# EAGLE design charger (EAGLE 7.5.0)
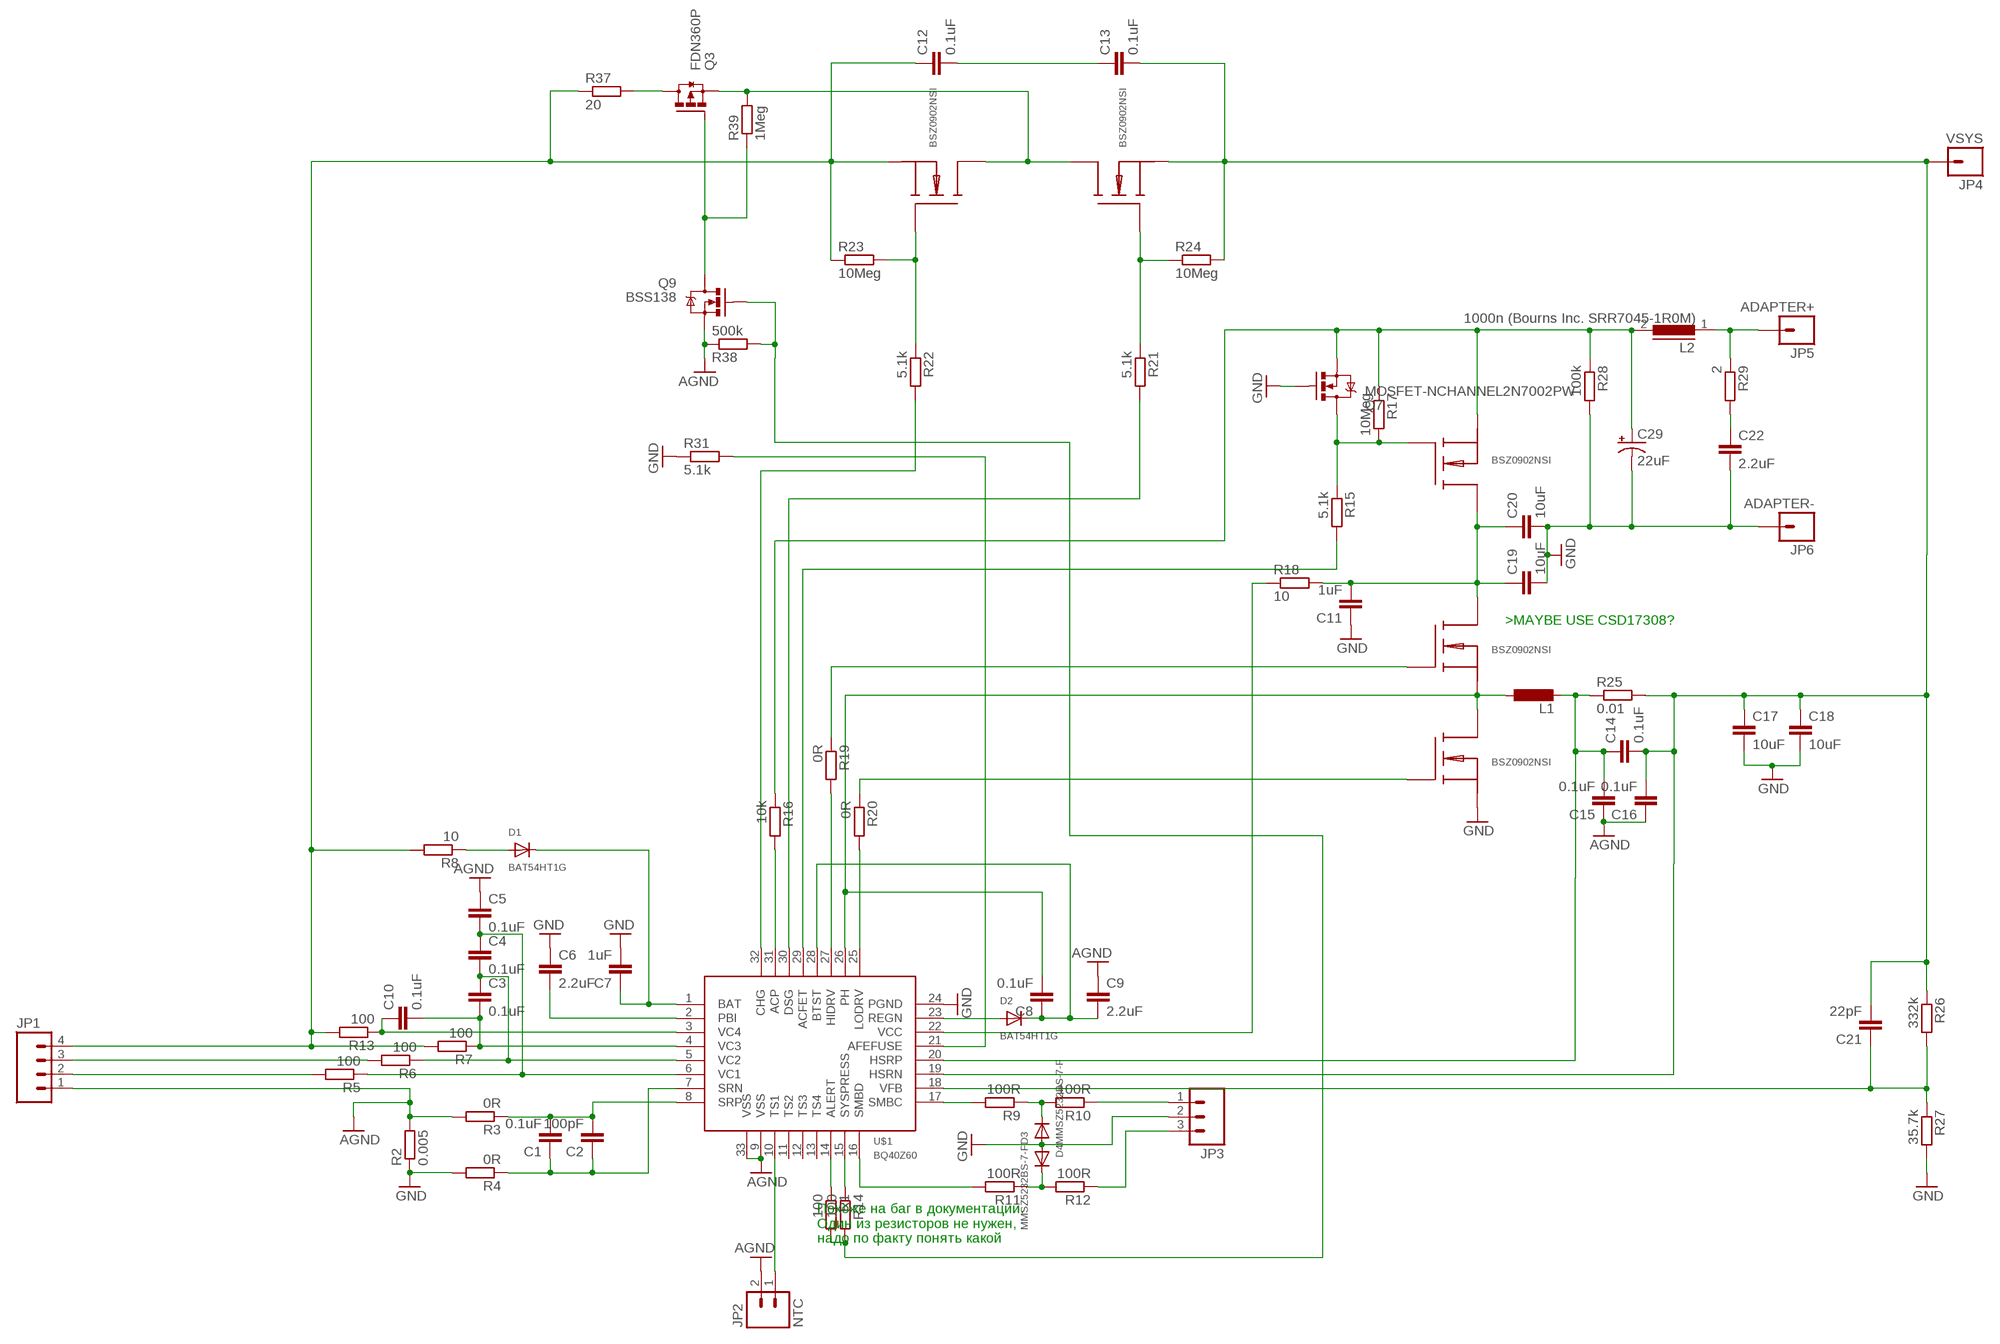
[diagram p0: schematic, sheet 1]

## Parts
C1  0.1uF  C-EUC0402  [C0402]
C2  100pF  C-EUC0402  [C0402]
C3  0.1uF  C-EUC0402  [C0402]
C4  0.1uF  C-EUC0402  [C0402]
C5  0.1uF  C-EUC0402  [C0402]
C6  2.2uF  C-EUC0805  [C0805]
C7  1uF  C-EUC0603  [C0603]
C8  0.1uF  C-EUC0402  [C0402]
C9  2.2uF  C-EUC0805  [C0805]
C10  0.1uF  C-EUC0402  [C0402]
C11  1uF  C-EUC0805  [C0805]
C12  0.1uF  C-EUC0402  [C0402]
C13  0.1uF  C-EUC0402  [C0402]
C14  0.1uF  C-EUC0402  [C0402]
C15  0.1uF  C-EUC0402  [C0402]
C16  0.1uF  C-EUC0402  [C0402]
C17  10uF  C-EUC1206  [C1206]
C18  10uF  C-EUC1206  [C1206]
C19  10uF  C-EUC1206  [C1206]
C20  10uF  C-EUC1206  [C1206]
C21  22pF  C-EUC0402  [C0402]
C22  2.2uF  C-EUC0805  [C0805]
C29  22uF  CAP_POL7343  [EIA7343]
D1  BAT54HT1G  DIODESOD-323F  [SOD-323F]
D2  BAT54HT1G  DIODESOD-323F  [SOD-323F]
D3  MMSZ5232BS-7-F  DIODESOD-323F  [SOD-323F]
D4  MMSZ5232BS-7-F  DIODESOD-323F  [SOD-323F]
JP1  M04PTH  [1X04]
JP2  NTC  M02PTH  [1X02]
JP3  M03PTH  [1X03]
JP4  VSYS  M01PTH_2MM  [1X01_2MM]
JP5  ADAPTER+  M01PTH_2MM  [1X01_2MM]
JP6  ADAPTER-  M01PTH_2MM  [1X01_2MM]
L1  L-EUL5650M  [L5650M]
L2  1000n (Bourns Inc. SRR7045-1R0M)  DR74  [DR74]
Q1  BSZ0902NSI  BSZ090X  [BSZ090X]
Q2  BSZ0902NSI  BSZ090X  [BSZ090X]
Q3  FDN360P  [SUPER-SOT3]
Q4  BSZ0902NSI  BSZ090X  [BSZ090X]
Q5  BSZ0902NSI  BSZ090X  [BSZ090X]
Q7  MOSFET-NCHANNEL2N7002PW  [SOT323]
Q8  BSZ0902NSI  BSZ090X  [BSZ090X]
Q9  BSS138  MOSFET-NCHANNEL2N7002PW  [SOT323]
R1  100  R-EU_R0402  [R0402]
R2  0.005  R-EU_R1210  [R1210]
R3  0R  R-EU_R0402  [R0402]
R4  0R  R-EU_R0402  [R0402]
R5  100  R-EU_R0603  [R0603]
R6  100  R-EU_R0603  [R0603]
R7  100  R-EU_R0603  [R0603]
R8  10  R-EU_R0603  [R0603]
R9  100R  R-EU_R0402  [R0402]
R10  100R  R-EU_R0402  [R0402]
R11  100R  R-EU_R0402  [R0402]
R12  100R  R-EU_R0402  [R0402]
R13  100  R-EU_R0603  [R0603]
R14  100  R-EU_R0402  [R0402]
R15  5.1k  R-EU_R0402  [R0402]
R16  10k  R-EU_R0402  [R0402]
R17  10Meg  R-EU_R0402  [R0402]
R18  10  R-EU_R1206  [R1206]
R19  0R  R-EU_R0402  [R0402]
R20  0R  R-EU_R0402  [R0402]
R21  5.1k  R-EU_R0402  [R0402]
R22  5.1k  R-EU_R0402  [R0402]
R23  10Meg  R-EU_R0402  [R0402]
R24  10Meg  R-EU_R0402  [R0402]
R25  0.01  R-EU_R2010  [R2010]
R26  332k  R-EU_R0402  [R0402]
R27  35.7k  R-EU_R0402  [R0402]
R28  100k  R-EU_R0402  [R0402]
R29  2  R-EU_R0603  [R0603]
R31  5.1k  R-EU_R0402  [R0402]
R37  20  R-EU_R1210  [R1210]
R38  500k  R-EU_R0402  [R0402]
R39  1Meg  R-EU_R0402  [R0402]
U$1  BQ40Z60  [BQ40Z60]

## Nets
AGND: C5.1 C9.1 C15.1 C16.1 JP1.1 JP2.2 Q9.2(S) R2.2 R3.2 R38.1 U$1.9(VSS) U$1.33(VSS)
GND [PWR]: C6.1 C7.2 C11.1 C17.2 C18.2 C19.2 C20.2 C22.2 C29.C(-) D3.A D4.A JP3.2 JP6.1 Q2.S@1(S) Q2.S@2(S) Q2.S@3(S) Q2.S@4(S) Q7.1(G) R2.1 R4.2 R27.2 R28.2 R31.1 U$1.24(PGND)
N$1: C1.2 C2.2 R3.1 U$1.8(SRP)
N$2: C1.1 C2.1 R4.1 U$1.7(SRN)
N$3: JP1.2 R5.2
N$4: C7.1 D1.C U$1.1(BAT)
N$5: C4.1 C5.2 R5.1 U$1.6(VC1)
N$6: C3.2 C10.2 R7.1 U$1.4(VC3)
N$7 [PWR]: JP1.4 R7.2 R8.2 R13.2
N$8: JP1.3 R6.2
N$9: C3.1 C4.2 R6.1 U$1.5(VC2)
N$10: C6.2 U$1.2(PBI)
N$11: D1.A R8.1
N$12: JP2.1 U$1.10(TS1)
N$13: R1.1 U$1.14(ALERT)
N$14: R9.2 U$1.17(SMBC)
N$15: R11.2 U$1.16(SMBD)
N$16: C10.1 R13.1 U$1.3(VC4)
N$17: D4.C R11.1 R12.2
N$18: D3.C R9.1 R10.2
N$19: JP3.1 R10.1
N$20: C22.1 R29.2
N$21 [PWR]: Q3.2(S) Q4.D Q4.D@1(D) Q4.D@2(D) Q4.D@3(D) Q4.D@4(D) Q5.D Q5.D@1(D) Q5.D@2(D) Q5.D@3(D) Q5.D@4(D) R39.2
N$22: JP3.3 R12.1
N$23: D2.A U$1.23(REGN)
N$24: C8.1 C9.2 D2.C U$1.28(BTST)
N$25: R31.2 U$1.21(AFEFUSE)
N$26 [PWR]: C12.1 Q4.S@1(S) Q4.S@2(S) Q4.S@3(S) Q4.S@4(S) R23.1 R37.1
N$27 [PWR]: C11.2 C19.1 C20.1 Q1.D Q1.D@1(D) Q1.D@2(D) Q1.D@3(D) Q1.D@4(D) Q8.D Q8.D@1(D) Q8.D@2(D) Q8.D@3(D) Q8.D@4(D) R18.2
N$28 [PWR]: C8.2 L1.1 Q1.S@1(S) Q1.S@2(S) Q1.S@3(S) Q1.S@4(S) Q2.D Q2.D@1(D) Q2.D@2(D) Q2.D@3(D) Q2.D@4(D) U$1.26(PH)
N$29: Q7.3(D) Q8.G R15.1 R17.2
N$30: R15.2 U$1.29(ACFET)
N$32: R16.2 U$1.31(ACP)
N$33: R18.1 U$1.22(VCC)
N$34: C21.1 R26.2 R27.1 U$1.18(VFB)
N$35: R19.2 U$1.27(HIDRV)
N$36: R20.2 U$1.25(LODRV)
N$37: Q1.G R19.1
N$38: Q2.G R20.1
N$39: R21.2 U$1.30(DSG)
N$40: Q5.G R21.1 R24.1
N$41: R22.2 U$1.32(CHG)
N$42: Q4.G R22.1 R23.2
N$43: C12.2 C13.1
N$44 [PWR]: C14.1 C15.2 L1.2 R25.1 U$1.20(HSRP)
N$45: C13.2 C14.2 C16.2 C17.1 C18.1 C21.2 JP4.1 Q5.S@1(S) Q5.S@2(S) Q5.S@3(S) Q5.S@4(S) R24.2 R25.2 R26.1 U$1.19(HSRN)
N$54: Q3.3(D) R37.2
N$56: Q9.1(G) R1.2 R14.2 R38.2
N$57: Q3.1(G) Q9.3(D) R39.1
N$58: R14.1 U$1.15(SYSPRESS)
N$59: C29.A(+) L2.2 Q7.2(S) Q8.S@1(S) Q8.S@2(S) Q8.S@3(S) Q8.S@4(S) R16.1 R17.1 R28.1
N$60: JP5.1 L2.1 R29.1
Unconnected: U$1.11(TS2) U$1.12(TS3) U$1.13(TS4)

## Notes on the sheet
- >MAYBE USE CSD17308?
- Похоже на баг в документации. 
  Один из резисторов не нужен, 
  надо по факту понять какой

## Library data of the parts
C1-C22 = resistor:C-EU: CAPACITOR, European symbol
C29 = SparkFun-Passives:CAP_POL: Capacitor Polarized These are standard SMD and PTH capacitors. Normally 10uF, 47uF, and 100uF in electrolytic and tantalum varieties. Always verify the external diameter of the through hole cap, it varies with capacity, voltage, and manufacturer. The EIA devices should be standard.
D1-D4 = adafruit:DIODE: Diode SMADIODE - SMA Surface Mount Package 20V 1A Schottky Diode Digikey: 641-1014-6-ND DO-1N4148 - Through Hole Small Current Diode SOD-123 20V 1 A (.5mV Vf) Schottky Diode - Digikey: MBRX120TPMSCT-ND SOD-323 10V 570mA (.38mV Vf, 3ns) Schottky Diode - Digikey: ZLLS410CT-ND SOD-523 30V 30mA Schottky Diode (RB751S-40TE61) - Digikey: RB751S-40TE61CT-ND SOT23-R/W - SOT23 Package (R = Solder Paste/Reflow Ovens, W = Hand-Soldering) BAT54Film 40V 300mA - Digikey: 497-7162-1-ND
JP1 = SparkFun-Connectors:M04: Header 4 Standard 4-pin 0.1" header. Use with straight break away headers (SKU : PRT-00116), right angle break away headers (PRT-00553), swiss pins (PRT-00743), machine pins (PRT-00117), and female headers (PRT-00115). Molex polarized connector foot print use with SKU : PRT-08231 with associated crimp pins and housings. 1MM SMD Version SKU: PRT-10208
JP2 = SparkFun-Connectors:M02: Standard 2-pin 0.1" header. Use with - straight break away headers ( PRT-00116) - right angle break away headers (PRT-00553) - swiss pins (PRT-00743) - machine pins (PRT-00117) - female headers (PRT-00115) Molex polarized connector foot print use with: PRT-08233 with associated crimp pins and housings. 2.54_SCREWTERM for use with PRT-10571. 3.5mm Screw Terminal footprints for PRT-08084 5mm Screw Terminal footprints for use with PRT-08432
JP3 = SparkFun-Connectors:M03: Header 3 Standard 3-pin 0.1" header. Use with straight break away headers (SKU : PRT-00116), right angle break away headers (PRT-00553), swiss pins (PRT-00743), machine pins (PRT-00117), and female headers (PRT-00115). Molex polarized connector foot print use with SKU : PRT-08232 with associated crimp pins and housings.
JP4-JP6 = SparkFun-Connectors:M01: Header 1 Standard 1-pin 0.1" header. Use with straight break away headers (SKU : PRT-00116), right angle break away headers (PRT-00553), swiss pins (PRT-00743), machine pins (PRT-00117), and female headers (PRT-00115).
L1 = rcl:L-EU: INDUCTOR, European symbol
L2 = inductors:DR74: High Power Density, High Efficiency, Shielded Inductors Source: coiltronics_dr_series.pdf
Q1 Q2 Q4 Q5 Q8 = vsd_custom:BSZ090X
Q3 = transistor-power:FDN360P: Single P-Channel, PowerTrench (R) MOSFET Source: http://www.fairchildsemi.com/ds/FD/FDN360P.pdf
Q7 Q9 = SparkFun-DiscreteSemi:MOSFET-NCHANNEL: Common NMOSFET Parts MFG P/N Store ID Prod ID FDD8780 TRANS-09984 SI7820DN TRANS-11055 FDS6630A IC-08089 2N7002PW TRANS-11151 FQP30N06L COM-10213 TRANS-10060 BSS123LT1G TRANS-08345 BSS138 TRANS-00830 BS170 2N7000; PROD_ID: TRANS-11151
R1-R29 R31 R37-R39 = resistor:R-EU_: RESISTOR, European symbol
U$1 = bq40z60:BQ40Z60

## Net classes
1 PWR: width 0.3 mm, drill 0.4 mm, clearance 0.152 mm

## Board
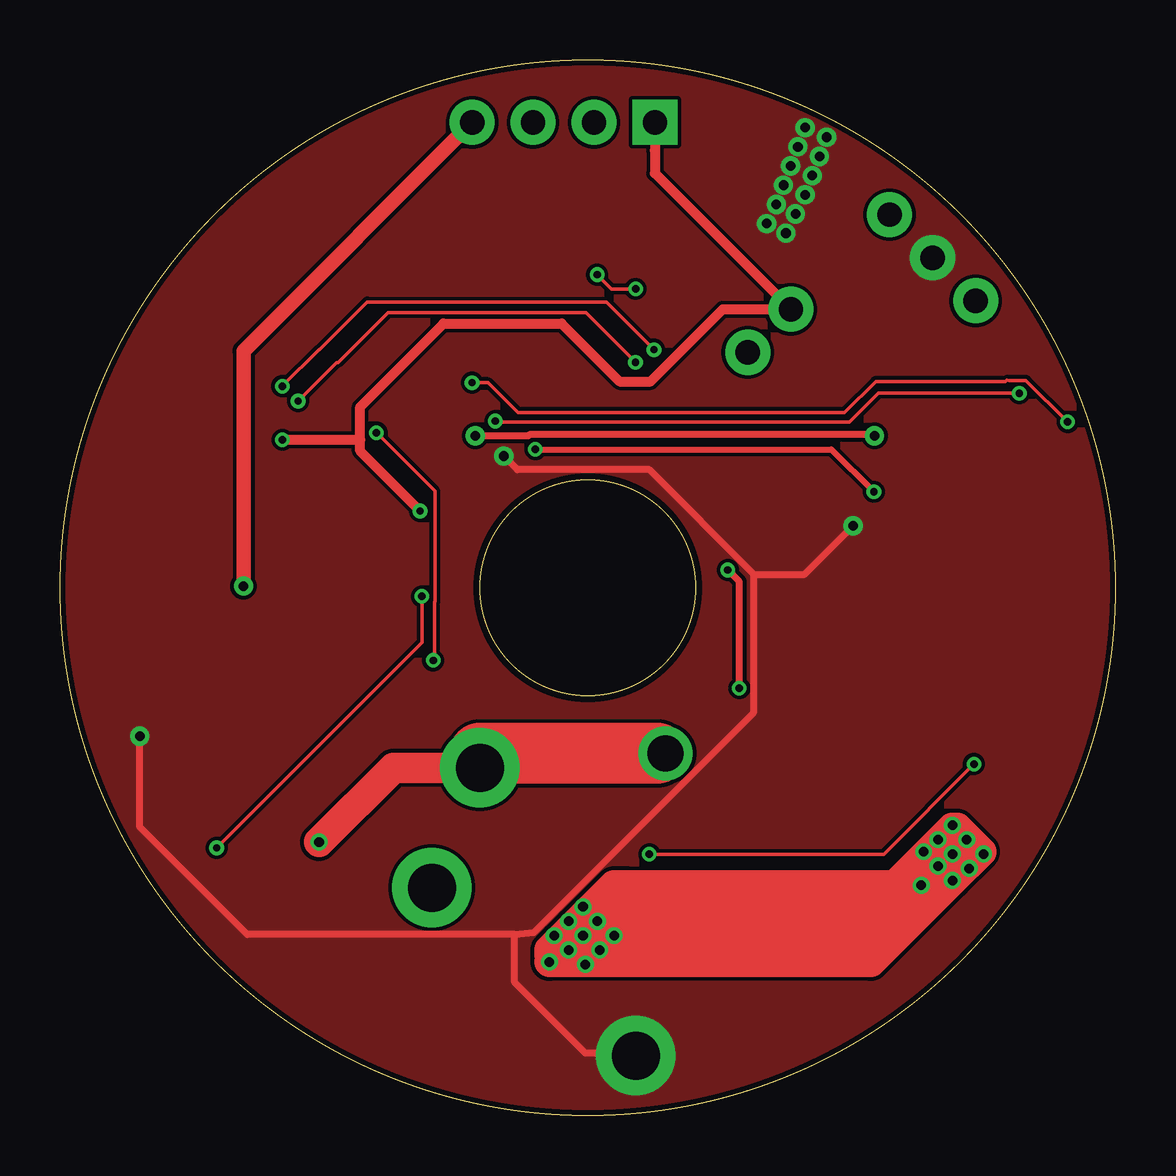
[diagram p1: board, top side]
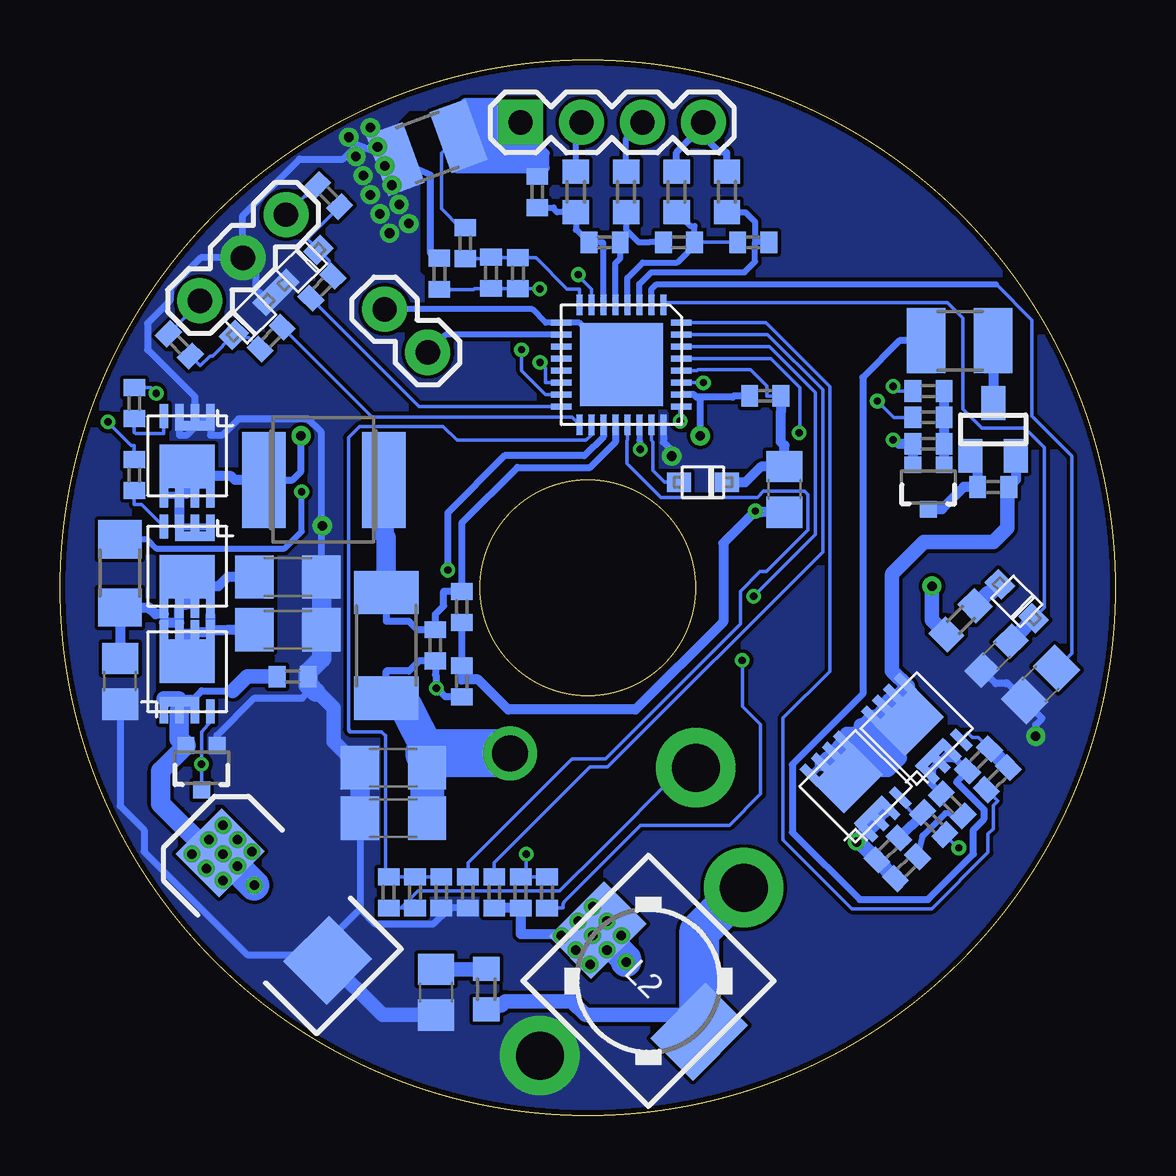
[diagram p2: board, bottom side, seen from below]

Size 44 x 44 mm. Coordinates in mm from the lower left corner, seen from the top.
Outline: circle at 22,22 radius 22
Outline: circle at 22,22 radius 4.5
Copper layers (1*16): Top 0.035mm / dielectric 1.5mm / Bottom 0.035mm
Design rules "SeeedStudio_2layer_DRU_no_angle_20140221": minimum track width 6mil, minimum drill 12mil, track to track 6mil, track to pad 6mil, pad to pad 6mil, via to via 6mil, smd to smd 0mil, copper to edge 10mil, drill to drill 10mil, minimum pad ring 10mil, minimum via ring 6mil, stop-mask expansion 2mil, vias tented up to drill 100mil, thermal gap 10mil
bRestrict: area 27.2,35.1 to 29.8,41.8

### Footprints (pad centres in the part's own frame; a part is rotated, then mirrored left to right if it is on the bottom)
C0402 = smd 0.7 x 0.9: 1 -0.65,0; 2 0.65,0
C0805 = smd 1.3 x 1.5: 1 -0.95,0; 2 0.95,0
C0603 = smd 1.1 x 1: 1 -0.85,0; 2 0.85,0
C1206 = smd 1.6 x 1.8: 1 -1.4,0; 2 1.4,0
EIA7343 = smd 2.55 x 2.7: A 3.17,0; C -3.17,0
SOD-323F = smd 1 x 0.8: A -1,0; C 1,0
1X04 = drill 1.016 pad 1.88 square: 1 0,0 | drill 1.016 pad 1.88: 2 2.54,0; 3 5.08,0; 4 7.62,0
1X02 = drill 1.016 pad 1.88: 1 0,0; 2 2.54,0
1X03 = drill 1.016 pad 1.88: 1 0,0; 2 2.54,0; 3 5.08,0
1X01_2MM = drill 2 pad 3.302: 1 0,0
L5650M = smd 1.8 x 4: 1 -2.5,0; 2 2.5,0
DR74 = smd 2.5 x 3.25: 1 -3,0; 2 3,0
BSZ090X = smd 1.8 x 2.3: D 0.44,0 | smd 1 x 0.35: D@1 1.65,-0.975; D@2 1.65,-0.325; D@3 1.65,0.325; D@4 1.65,0.975; G -1.65,-0.975; S@2 -1.65,-0.325; S@3 -1.65,0.325; S@4 -1.65,0.975 | smd 0.4 x 1.65: S@1 -1.25,0.325
SUPER-SOT3 = smd 1 x 1.4: 1 -0.95,-1.1; 2 0.95,-1.1; 3 0,1.1
SOT323 = smd 0.7 x 0.7: 1 -0.65,-0.925; 2 0.65,-0.925; 3 0,0.925
R0402 = smd 0.7 x 0.9: 1 -0.65,0; 2 0.65,0
R1210 = smd 1.6 x 2.7: 1 -1.4,0; 2 1.4,0
R0603 = smd 1 x 1.1: 1 -0.85,0; 2 0.85,0
R1206 = smd 1.6 x 1.803: 1 -1.422,0; 2 1.422,0
R2010 = smd 1.8 x 2.7: 1 -2.2,0; 2 2.2,0
BQ40Z60 = smd 0.85 x 0.25: 1 -2.5,1.75; 2 -2.5,1.25; 3 -2.5,0.75; 4 -2.5,0.25; 5 -2.5,-0.25; 6 -2.5,-0.75; 7 -2.5,-1.25; 8 -2.5,-1.75; 17 2.5,-1.75; 18 2.5,-1.25; 19 2.5,-0.75; 20 2.5,-0.25; 21 2.5,0.25; 22 2.5,0.75; 23 2.5,1.25; 24 2.5,1.75 | smd 0.25 x 0.85: 9 -1.75,-2.5; 10 -1.25,-2.5; 11 -0.75,-2.5; 12 -0.25,-2.5; 13 0.25,-2.5; 14 0.75,-2.5; 15 1.25,-2.5; 16 1.75,-2.5; 25 1.75,2.5; 26 1.25,2.5; 27 0.75,2.5; 28 0.25,2.5; 29 -0.25,2.5; 30 -0.75,2.5; 31 -1.25,2.5; 32 -1.75,2.5 | smd 3.45 x 3.45: 33 0,0

### Placement (x,y rotation side)
C1  24.91,35.11 90 bottom
C2  26.03,35.13 90 bottom
C3  18.2,36.4 0 bottom
C4  21.3,36.4 0 bottom
C5  24.1,38.5 270 bottom
C6  3.13,17.97 45 bottom
C7  4.96,19.17 225 bottom
C8  14.6,30 180 bottom
C9  13.8,26.1 90 bottom
C10  15.1,36.4 180 bottom
C11  41.5,18.1 90 bottom
C12  6.8,12.95 315 bottom
C13  8.71,10.33 225 bottom
C14  28.35,19.6 270 bottom
C15  27.25,21.2 90 bottom
C16  27.25,18.1 270 bottom
C17  30.1,14.5 180 bottom
C18  30.1,12.4 180 bottom
C19  34.5,20.25 0 bottom
C20  34.5,22.45 0 bottom
C21  29.2,9.3 270 bottom
C22  28.32,5.14 270 bottom
C29  35.08,8.71 135 bottom
D1  4.12,21.43 315 bottom
D2  17.2,26.4 0 bottom
D3  36.05,33.25 225 bottom
D4  33.93,35.38 45 bottom
JP1  24.8,41.4 0 bottom
JP2  28.67,31.81 135 bottom
JP3  38.17,33.96 45 bottom
JP4  17.5,14.5 0 top
JP5  15.5,9.5 0 top
JP6  24,2.5 0 top
L1  33,26.5 0 bottom
L2  19.47,5.61 135 bottom
Q1  38.7,22.9 270 bottom
Q2  38.7,27.5 270 bottom
Q3  5.1,28.6 0 bottom
Q4  8.29,16.13 135 bottom
Q5  10.83,13.73 135 bottom
Q7  38.1,14.5 180 bottom
Q8  38.7,18.5 90 bottom
Q9  7.8,26.2 180 bottom
R1  7.8,29.1 0 bottom
R2  28.7,40.35 20 bottom
R3  27.11,36.37 90 bottom
R4  28.18,35.09 90 bottom
R5  22.5,38.5 90 bottom
R6  20.4,38.5 90 bottom
R7  18.3,38.5 90 bottom
R8  6.45,20.66 225 bottom
R9  35.2,32.41 45 bottom
R10  39.02,32.12 315 bottom
R11  33.08,34.53 225 bottom
R12  32.8,38.35 315 bottom
R13  16.2,38.5 90 bottom
R14  7.8,30.2 0 bottom
R15  23.7,9.3 270 bottom
R16  25.9,9.3 90 bottom
R17  24.8,9.3 90 bottom
R18  41.5,22.6 270 bottom
R19  40.9,26.7 90 bottom
R20  40.9,29.7 90 bottom
R21  7.58,12.17 315 bottom
R22  4.93,14.04 225 bottom
R23  5.71,14.82 45 bottom
R24  9.49,11.11 225 bottom
R25  30.4,19.6 270 bottom
R26  30.3,9.3 90 bottom
R27  28.1,9.3 270 bottom
R28  34.3,18.3 0 bottom
R29  26.23,5.27 90 bottom
R31  27,9.3 90 bottom
R37  6.5,32.3 0 bottom
R38  7.8,28 0 bottom
R39  5.1,26.2 0 bottom
U$1  20.6,31.3 270 bottom

### Tracks (layer width: path | path; a pad name or v marks a point on that pad's centre or on a via)
AGND  (via drill 0.3 pad 0.61)
  Top 0.3: JP2.2 | JP2.2
  Top 0.406: 12.51,28.17 v9.27,28.17 | 12.51,28.17 12.51,29.54 15.99,33.02 20.91,33.02 23.33,30.59 24.62,30.59 27.63,33.61 JP2.2 24.8,39.27 24.8,40.23 JP1.1 | v15.01,25.2 12.51,27.7 12.51,28.17
  Bottom 0.152: 9.2,28.17 v9.27,28.17 | JP1.1 24.8,40.82 | R3.2 27.32,37.02 28.1,37.8 28.1,40.12 R2.2
  Bottom 0.25: JP2.2 24.31,33.61 23.75,33.05 U$1.9 22.35,33.05 U$1.33
  Bottom 0.3: C16.1 C15.1 | JP2.2
  Bottom 0.406: 9.2,28.17 9.03,28 R38.1 Q9.2 | R2.2 25.4,40.3 25.9,40.8 26.1,40.8 25.4,40.1 24.7,40.1 26.2,41.6 26.3,41.5 26.3,40.8 25.9,40.4 25.9,39.9 24.1,39.9 26.1,41.9 26.6,41.9 26.8,41.7 26.9,41.7 26.5,41.3 26.5,39.7 26.4,39.8 26.4,40.5 26.1,40.2 26.1,39.8 26.4,39.5 27.5,39.5 23.8,39.5 23.8,40.1 24,40.3 25.9,42.2 27.1,42.2 25.88,40.98 25.88,40.28 25.35,40.82 24.8,40.82 24.8,40.23 24.6,40.23 24.1,39.73 C5.1 | C16.1 27.25,18.17 26.57,18.17 25.32,16.92 20.01,16.92 16.35,20.58 16.35,23.86 v15.01,25.2 14.96,25.15 14.78,25.15 C9.1
GND  (via drill 0.4 pad 0.8)
  Top 0.3: 28.93,22.55 24.56,26.92 19.07,26.92 v18.5,27.49 | 18.96,7.54 19.76,7.63 28.93,16.8 28.93,22.55 | 28.93,22.55 31.03,22.55 v33.06,24.58 | JP6.1 23.96,2.54 23.2,2.3 22.9,2.6 21.9,2.6 18.96,5.54 18.96,7.54 | 18.96,7.54 7.81,7.54 3.33,12.03 v3.33,15.81
  Bottom 0.3: 37.73,29.01 37.73,28.35 37.25,28.35 36.55,29.04 33.66,29.04 33.1,28.48 33.1,24.58 | C20.2 33.1,24.58 | v33.06,24.58 33.1,24.58 | C18.2 31.5,8.62 | 31.5,8.62 30.88,8 28.43,8 28.1,8.32 | C6.1 3.05,16.56 3.33,16.29 v3.33,15.81 | R31.1 27.75,8.65 28.08,8.32 28.1,8.32 | JP3.2 36.38,37.52 34.02,39.87 32.2,39.87 31.62,40.46 R2.1 28.56,39.21 28.56,35.96 28.4,35.8 28.28,35.73 R4.2 | JP3.2 38.13,35.76 39.42,34.48 39.42,33.96 40.35,33.03 40.35,31.93 38.38,29.95 Q2.S@3 38.38,29.01 | C6.1 4.18,17.69 4.54,18.05 4.58,18 5,18 | v18.5,27.49 18.5,27.72 18.85,28.07 U$1.24 | D4.A 35.2,34.1 35.31,34.21 35.59,34.21 | 38.38,29.01 Q2.S@1 38.38,28.7 38.72,28.35 39.02,28.35 Q2.S@2 | 37.73,29.01 38.38,29.01 | Q2.S@4 37.73,29.01 | 35.59,34.21 35.84,34.46 | D3.A 35.59,34.21 | R27.2 28.1,8.32 | C7.2 5,18 | 5,18 | JP3.2 35.84,35.22 35.84,34.46 | 35.84,34.46 | C6.1 | C7.2 | C7.2 | Q7.1 37.45,15.85 35.9,17.4 33.9,17.4 33.5,17.8 | C11.1 41.5,12.9 40.5,11.9 40.5,11 36.2,6.7 33.57,6.7 C29.C 33.44,6.67 31.5,8.62
  Bottom 0.406: D4.A | D3.A
  Bottom 0.61: 33.65,17.95 33.55,17.95 32.6,17 32.6,15.6 C17.2 | C22.2 30.56,4.19 C29.C
  Bottom 0.813: C20.2 C19.2 33.1,19.05 33.65,18.5 R28.2 33.65,17.95 33.5,17.8 33.35,17.65 | C17.2 C18.2
  other vias: 31.06,41.18 30.76,40.38 30.46,39.58 30.16,38.78 29.86,37.98 29.46,37.18 31.96,40.78 31.66,39.98 31.36,39.18 31.06,38.38 30.66,37.58 30.26,36.78
  pour Top (no thermals): 0,0.2 44.3,0.2 44.3,44.2 0,44.2
  pour Bottom (no thermals): 0,0 44,0 44,44 0,44
N$1
  Bottom 0.152: 22.55,34.45 22.86,34.45 24.16,35.76 C1.2 25.59,35.76 25.6,35.78 C2.2 26.36,35.78 26.43,35.72 R3.1 | 22.55,34.45 | 22.55,34.45 22.47,34.45 22.35,34.45 U$1.8
N$2  (via drill 0.3 pad 0.61)
  Top 0.152: v24,34.46 22.98,34.46 v22.39,35.05
  Bottom 0.152: U$1.7 21.85,34.45 22.39,34.99 v22.39,35.05 | v22.39,35.05 | v24,34.46 24.23,34.46 C1.1 25.34,34.46 25.35,34.48 C2.1 26.71,34.48 26.75,34.44 R4.1
N$3
  Bottom 0.25: R5.2 22.5,41.16 JP1.2
N$4
  Bottom 0.152: U$1.1 18.77,33.88 7,33.88 6.37,33.25 6.37,29.44 5.58,28.66 3.78,28.66 2.96,27.84 2.96,21.17 D1.C 3.47,20.67 3.63,20.5 | C7.1 | C7.1
  Bottom 0.3: D1.C | D1.C 3.47,20.67 | C7.1
  Bottom 0.61: 3.63,20.5 3.85,20.28 C7.1
N$5
  Bottom 0.152: 21.35,36.38 21.37,36.4
  Bottom 0.25: 21.37,36.4 C4.1 22.47,36.92 22.5,36.92 R5.1 23.28,37.65 23.42,37.79 23.42,37.85 C5.2 | U$1.6 21.35,36.38
N$6
  Bottom 0.152: 17.83,35.99 17.83,36.4 C3.2 C10.2
  Bottom 0.25: U$1.4 20.35,34.92 19.71,35.56 18.26,35.56 17.83,35.99 | C3.2 17.55,37.08 17.73,37.08 R7.1
N$7  (via drill 0.4 pad 0.8)
  Top 0.61: JP1.4 7.65,31.87 v7.65,22.07
  Bottom 0.3: R13.2 16.2,40.15 16.5,40.15 17.18,40.83 | 17.18,40.83 17.62,40.83 18.3,40.15 R7.2 | 17.18,40.83 JP1.4 | R8.2
  Bottom 0.61: v7.65,22.07 7.65,20.66 R8.2
N$8
  Bottom 0.25: R6.2 20.4,40.72 JP1.3
N$9
  Bottom 0.152: 20.4,37 20.4,36.92
  Bottom 0.25: U$1.5 20.85,35.52 20.65,35.72 C4.2 20.26,36.79 | 20.26,36.79 19.88,36.4 19.43,36.4 C3.1 | 20.4,36.92 20.26,36.79 | R6.1 20.4,37
N$10
  Bottom 0.152: 4.98,34.65 3.48,33.16 3.48,29.15 1.83,27.5 1.83,19.27 C6.2
  Bottom 0.25: U$1.2 19.35,34.44 19.14,34.65 4.98,34.65
N$11
  Bottom 0.152: 5.33,21.77
  Bottom 0.3: D1.A
  Bottom 0.61: R8.1 5.33,21.77 5.19,21.77 D1.A
N$12
  Bottom 0.25: U$1.10 27.93,32.55 JP2.1
N$13  (via drill 0.3 pad 0.61)
  Top 0.152: v23.99,31.39 23.9,31.5 21.93,33.47 13.67,33.47 11.59,31.39 11.53,31.39 v9.93,29.78
  Bottom 0.152: U$1.14 23.75,30.55 23.75,31.15 v23.99,31.39 | v9.93,29.78 9.24,29.1 R1.1
N$14
  Bottom 0.152: U$1.17 22.66,29.11 30.98,29.11 34.32,32.44 R9.2
  Bottom 0.406: R9.2
N$15
  Bottom 0.152: U$1.16 29.02,29.55 33.49,34.01 R11.2
  Bottom 0.406: R11.2 | R11.2 33.49,34.01
N$16
  Bottom 0.25: U$1.3 19.85,34.66 19.35,35.16 15.47,35.16 15.03,35.59 15.03,36.4 | C10.1 15.03,36.4 | R13.1 15.42,37.65 15.03,37.26 15.03,36.4
N$17
  Bottom 0.152: R11.1 32.78,35.14 32.78,35.64 D4.C 33.67,36.53 33.67,36.56 32.41,37.81 R12.2
  Bottom 0.406: R12.2 | R12.2 32.41,37.81 | R11.1 | D4.C
N$18
  Bottom 0.152: R9.1 36.14,32.43 | 36.14,32.43 | 36.14,32.43 36.64,32.43 D3.C 36.8,32.5 37.64,31.66 37.74,31.66 38.15,31.25 R10.2
  Bottom 0.406: D3.C | D3.C 36.8,32.5 | R9.1
N$19
  Bottom 0.152: R10.1 38.17,33.89 JP3.1
N$20
  Bottom 0.3: 26.6,6.09 R29.2
  Bottom 0.61: C22.1 26.6,6.09
N$21
  Bottom 0.3: 4.51,26.2 R39.2 | 4.15,26.5 | Q5.D@3 12.3,14.6 | 12.3,14.6 Q5.D@4 | 11.99,14.89 12.01,14.89 | Q4.D 9.45,17.29 9.46,17.3 9.52,17.24 9.63,17.13 | 11.99,14.89 11.99,14.9 Q5.D@2 Q5.D@1 | 10.48,16.27 10.62,16.27 | 9.58,16.97 9.63,17.13 | Q5.D 11.99,14.89 | 8.66,17.89 Q4.D@1 | 9.12,17.43 Q4.D@2 | Q4.D@2 | Q4.D | Q4.D | Q4.D@3 | Q4.D@3 9.63,17.13 | Q4.D@4 | Q4.D@4 9.98,16.58 | Q5.D | Q5.D@3 | Q5.D@3 12.3,14.6 | Q5.D@4 | Q5.D@1 | Q5.D@1 11.35,15.55
  Bottom 0.406: R39.2 4.15,26.5 | Q3.2 4.15,26.5
  Bottom 0.61: 4.51,26.2 4.51,24.48 5.1,23.9 8,23.9 9.3,22.6 9.33,22.49 9.33,18.52 8.66,17.89 9.12,17.43 9.46,17.3 | 12.01,14.89 Q5.D@3 | Q5.D@2 11.35,15.55 Q5.D@1 9.6,14.9 10.4,15.7 10.6,15.9 11.2,15.9 9.7,14.4 9.5,14.4 9,14.9 10.37,16.27 10.62,16.27 | 10.48,16.27 Q4.D@4 9.98,16.58 9.58,16.97
N$22
  Bottom 0.152: R12.1 33.74,38.33 33.81,38.33 JP3.3
  Bottom 0.406: R12.1
N$23
  Bottom 0.152: U$1.23 19.35,28.15 19.29,28.08 19.29,27.18 19.29,26.89 18.8,26.4 D2.A
N$24
  Bottom 0.152: C8.1 14.53,30 14.53,30.41 15.21,31.09 17.41,31.09 17.45,31.05 U$1.28
  Bottom 0.406: D2.C 15.43,26.4 14.78,27.05 C9.2 13.8,27.93 13.95,28.08 13.95,29.32 C8.1
N$25
  Bottom 0.152: R31.2 27,10.53 22.66,14.87 21.26,14.87 15.64,20.49 15.64,21.85 14.82,22.67 14.55,22.67 12.82,24.4 12.82,25.89 12.96,26.03 14.67,26.03 14.93,25.77 18.95,25.77 20.36,27.18 20.36,28.14 20.35,28.15 U$1.21
N$26
  Bottom 0.3: R23.1 | R23.1 6.63,13.9 5.47,12.74 5.47,12.37 5.92,11.91 5.92,10.9 7.82,9.01 10.66,9.01 13.47,11.81 13.47,14.63 10.53,17.57 10.53,30.77 9,32.3 R37.1 | C12.1 7.72,13.87 7.64,13.95 7.64,14.44 | 7.64,14.44 7.47,14.61 7.49,14.63 7.49,14.88 | Q4.S@4 7.64,14.44 | 7.49,14.88 Q4.S@3 | Q4.S@3 | Q4.S@1 | Q4.S@1 7.49,14.88 | R23.1 6.7,14.89 6.74,14.86 7.23,14.86 | Q4.S@3 7.23,14.86 | 6.94,15.14 Q4.S@2 6.94,15.14 | 6.94,15.14 7.23,14.86 | 7.23,14.86 | C12.1 | Q4.S@4 | Q4.S@3 Q4.S@1 | R23.1
N$27
  Bottom 0.3: Q1.D@1 39.67,20.9 39.67,20.55 Q8.D@4 | 37.73,22.05 Q1.D@4 37.73,20.85 | Q8.D@1 37.73,20.25 | 39.02,20.55 Q8.D@3 39.02,20.14 38.7,20.14 | 38.7,20.14 38.69,20.15 Q8.D@2 | 38.7,21.25 Q1.D@3 | Q1.D@2 38.7,21.25 | 38.7,21.25 38.7,21.26 Q1.D | Q8.D 38.7,20.14
  Bottom 0.406: 39.67,20.9 40.02,20.9 40.3,21.18 R18.2 C11.2 | C20.1 37,22.45 37.4,22.05 37.73,22.05 | 37.73,20.85 37.73,20.25 37,20.25 C19.1 | 39.67,20.55 39.02,20.55 Q1.D@2 | Q8.D@2 Q8.D@1
N$28  (via drill 0.4 pad 0.8)
  Top 0.3: v33.95,28.33 33.91,28.38 19.57,28.38 19.52,28.33 v17.31,28.33
  Bottom 0.3: 37.73,26.25 37.73,26.65 | Q2.D@4 37.73,26.25 | 37.73,26.25 38.38,26.25 | L1.1 34.9,26.5 34.3,26.5 33.95,26.85 v33.95,28.33 | Q1.S@2 Q1.S@3 | 38.7,26.25 38.7,25.86 39.02,25.86 Q2.D@2 Q2.D@1 | Q2.D 38.7,26.25 | Q2.D@3 38.38,26.25 | 38.38,26.25 38.7,26.25 | Q1.S@3 Q1.S@4 | 17.31,29.94 v17.31,28.33 | 17.31,29.94 15.96,29.94 15.9,30 C8.2 | 17.31,29.94 17.46,29.94 17.57,30.05 U$1.26 | Q1.S@3 Q1.S@1
  Bottom 0.406: L1.1 36.7,26.5 36.85,26.65 37.73,26.65 | Q2.D@2 Q1.S@2
N$29  (via drill 0.3 pad 0.61)
  Top 0.152: v24.56,10.89 34.34,10.89 v38.1,14.65
  Bottom 0.152: Q8.G 37.73,16.42 38.1,16 v38.1,14.65 Q7.3 | 24.56,9.95 24.38,9.95 23.96,9.95 R15.1 | R17.2 24.56,9.95 | 24.56,9.95 v24.56,10.89
N$30  (via drill 0.3 pad 0.61)
  Top 0.152: v15.56,18.97 15.56,18.77 15.62,19.11 15.62,21.42 15.63,21.42 15.63,26.03 v13.19,28.46
  Bottom 0.152: v13.19,28.46 13.17,28.39 13.17,30.34 14.37,31.55 17.45,31.55 U$1.29 | R15.2 23.02,8.65 23.02,8.81 23,8.9 19.8,12.1 16.1,12.1 14.8,13.4 14.8,16.3 15.56,17.06 v15.56,18.97
N$32
  Bottom 0.152: R16.2 25.9,10.53 21.9,14.53 21.17,14.53 12.21,23.49 12.21,30.26 14.5,32.55 17.45,32.55 U$1.31
N$33  (via drill 0.3 pad 0.61)
  Top 0.25: v19.82,27.77 32.16,27.77 v33.92,26
  Bottom 0.25: v33.92,26 33.92,24.35 34.63,23.64 39.99,23.64 40.37,24.02 R18.1 | U$1.22 19.85,28.15 19.82,28.11 v19.82,27.77
N$34
  Bottom 0.152: U$1.18 21.85,28.36 22.07,28.15 27.46,28.15 28.04,28.73 31.5,28.73 31.98,28.25 31.98,16.1 31.9,16 30.6,16 30.45,15.85 30.43,15.85 30.43,10.07 30.3,10.24 | 30.3,10.24 30.17,10.24 29.88,9.95 C21.1 R27.1 | R26.2 30.3,10.24
N$35  (via drill 0.3 pad 0.61)
  Top 0.152: v42,28.91 40.27,30.64 39.57,30.64 39.48,30.65 39.4,30.6 34,30.6 32.7,29.3 19.1,29.3 17.85,30.55 v17.18,30.55
  Bottom 0.152: U$1.27 17.45,30.55 v17.18,30.55 | v42,28.91 41.02,27.93 40.9,27.93 R19.2
N$36  (via drill 0.3 pad 0.61)
  Top 0.152: v39.99,30.11 34.11,30.11 32.9,28.9 18.3,28.9 18.2,29 18.11,29.01 v18.15,28.95
  Bottom 0.152: R20.2 40.22,30.35 40.22,30.34 v39.99,30.11 | U$1.25 18.15,29.5 v18.15,28.95
N$37
  Bottom 0.152: R19.1 40.9,25.47 40.6,25.47 Q1.G
N$38
  Bottom 0.152: R20.1 40.9,28.47 40.85,28.42 39.67,28.42 Q2.G
N$39  (via drill 0.3 pad 0.61)
  Top 0.152: v15.09,21.64 15.09,19.71 v6.53,11.15
  Bottom 0.152: 6.71,11.3 | 6.71,11.3 6.68,11.3 v6.53,11.15 | v15.09,21.64 12.51,24.22 12.51,30.12 14.44,32.05 U$1.30 | R21.2 6.71,11.3
  Bottom 0.406: R21.2
N$40
  Bottom 0.152: 8.26,12.41 8.98,13.13 Q5.G | 8.26,12.41 8.52,12.15 | R21.1 8.19,12.48 8.26,12.41 | 8.52,12.08 8.52,12.15 | 8.52,12.15
  Bottom 0.3: R21.1 | R21.1 8.19,12.48 | Q5.G
  Bottom 0.406: 8.52,12.08 8.1,12.5 R24.1
N$41
  Bottom 0.152: U$1.32 14.57,33.05 11.9,30.38 11.9,18.52 13.86,16.56 13.86,11.49 10.99,8.62 7.66,8.62 5.32,10.97 5.32,11.73 5.09,11.96 5.09,12.92 4.91,13.11 R22.2
N$42
  Bottom 0.152: R23.2 5.73,15.76 | 5.73,15.76 | 5.73,15.76 5.97,15.76 6.15,15.94 Q4.G
  Bottom 0.3: R23.2 | Q4.G
  Bottom 0.61: R22.1 R23.2
N$43
  Bottom 0.22: 7.1,12.6 8,11.7
  Bottom 0.25: C12.2 6.79,12.49 6.9,12.6 7.1,12.6 | 8,11.7 8.05,11.65 C13.1
N$44
  Bottom 0.3: R25.1 30.4,21.26 30.4,20.6 29.45,20.6 29.1,20.25 C14.1 28.35,20.9 28,21.25 28,21.85 C15.2 27.23,21.87 27.23,24.72 24.93,27.02 21.9,27.02 20.85,28.07 U$1.20
  Bottom 0.813: L1.2 30.5,24.2 30.4,24.1 R25.1
N$45  (via drill 0.3 pad 0.61, 0.4 pad 0.61, 1.5 pad 0.61)
  Top 0.3: v28.31,17.81 28.31,22.26 v27.84,22.74
  Top 1.27: 24.9,15.1 v25.25,15.1 | JP4.1 13.9,14.5 v10.8,11.4
  Top 2.54: 24.9,15.1 17.5,15.1 JP4.1
  Bottom 0.152: 28.6,15.1 C17.1 | 29.6,17.06 30.4,17.86 R25.2 | 29.78,8.65 29.07,9.36 23.17,9.36 21.43,11.1 18.33,14.22 | R26.1 29.78,8.65 | 29.78,8.65 29.62,8.65 29.33,8.94 29.2,8.94 C21.2 | v28.31,17.81 28.29,17.81 | v10.8,11.4 10.7,11.4 10.7,11.53 | Q5.S@3 Q5.S@1
  Bottom 0.3: 30.4,17.86 30.4,18.53 29.45,18.53 29.03,18.95 C14.2 28.35,18.37 28.31,18.34 v28.31,17.81 | 28.29,17.81 27.93,17.45 C16.2 | U$1.19 21.35,28.29 22.14,27.5 25.46,27.5 27.84,25.12 v27.84,22.74
  Bottom 0.4: 18.95,14.5 JP4.1 18.05,14.5 18.33,14.22
  Bottom 0.406: Q5.S@3 Q5.S@2
  Bottom 0.61: 10.7,11.4 R24.2 C13.2 | 10.7,11.53 Q5.S@4 Q5.S@3
  Bottom 1.27: 17.45,14.5 JP4.1
  Bottom 1.422: 29.6,17.06 28.6,15.1 | C17.1 C18.1
  Bottom 2: v25.25,15.1 28.6,15.1
N$54
  Bottom 0.406: R37.2 Q3.3
N$56
  Bottom 0.406: R14.2 R1.2 R38.2 Q9.1
N$57
  Bottom 0.152: 7.22,25.27 7.22,25.31 | 5.75,26.88 6.05,27.18 Q3.1
  Bottom 0.406: Q9.3 7.22,25.27 | 7.22,25.31 6.33,26.2 R39.1 5.75,26.88
N$58  (via drill 0.3 pad 0.61)
  Top 0.152: v9.27,30.4 10.79,31.92 10.82,31.92 12.81,33.91 22.79,33.91 24.6,32.1 v24.76,31.92
  Bottom 0.152: v24.76,31.92 24.76,31.06 23.75,30.05 U$1.15 | v9.27,30.4 9.07,30.2 9.03,30.2 R14.1
N$59  (via drill 0.4 pad 0.61)
  Top 0.406: v20.6,7.5 20.7,7.5 20.85,7.35 20.85,7.25 v21.2,6.9 | 22.2,7.6 22.2,7.2 v22.5,6.9 | v23.1,7.5 v22.5,6.9 | v22.5,6.9 v21.9,6.3 | v36,11 v36.6,10.4 | v36.6,11.5 v36.6,10.4 | v37.2,12.1 37.2,12 | 36.7,10.8 36.7,10.5 v36.6,10.4 | v37.2,9.8 v36.6,10.4 | v37.8,11.5 37.85,11.55 | 38.4,11 v38.5,10.9 | 37.5,10.8 37.5,10.7 v37.9,10.3 | v21.2,8.1 21.2,8 v21.2,8.1
  Top 1.27: v35.9,9.6 35.9,9.3 36,9.3 37.5,10.8 36.7,10.8 35.3,9.4 23.6,9.6 23.5,8.3 23.6,8.4 33.2,8.4 32.4,7.6 22.2,7.6 23.5,8.9 34.9,8.9 32.7,6.7 20.4,6.7 20.4,6.9 20.85,7.35 23.1,9.6 34.8,9.6 37.2,12 37.4,12 37.85,11.55 38.4,11 v37.2,9.8 33.8,6.4 v20.4,6.4
  Bottom 0.152: 21.93,7.57 L2.2 | Q8.S@1 39.02,17.38 | Q8.S@4 39.67,17.38
  Bottom 0.3: 36.8,17.7 38.1,17.7 38.55,17.25 38.55,17.02 Q8.S@2 | 38.02,11.22 C29.A 37.25,10.95
  Bottom 0.406: R16.1 R17.1 24.8,7.57 21.93,7.57 | L2.2 21.59,7.71 v21.8,7.5 | L2.2 22.03,7.73 v22.4,8.1 v21.8,8.7 | L2.2 21.57,7.73 v21.2,8.1 | 37.25,10.95 v37.2,10.9
  Bottom 0.61: 39.67,17.38 39.02,17.38 | R28.1 36.2,18.3 36.8,17.7 | 38.55,17.25 Q8.S@1 Q8.S@3
  Bottom 0.813: Q8.S@3 39.02,15.7 Q7.2 39.8,14.38 39.8,13 38.02,11.22
  Bottom 1.27: 37.25,10.95 v37.2,10.9 v35.9,9.6 | v20.4,6.4 20.4,6.54 L2.2
N$60
  Bottom 0.3: 18.06,4.2 L2.1
  Bottom 0.61: R29.1 25.6,4.6 25.43,4.77 22.67,4.77 22.1,4.2 18.06,4.2
  Bottom 1.676: L2.1 17.35,7.65 JP5.1